# EAGLE design alarm_lamp (EAGLE 8.3.2)

## Sheet 1 of 2: Arduino and peripherals
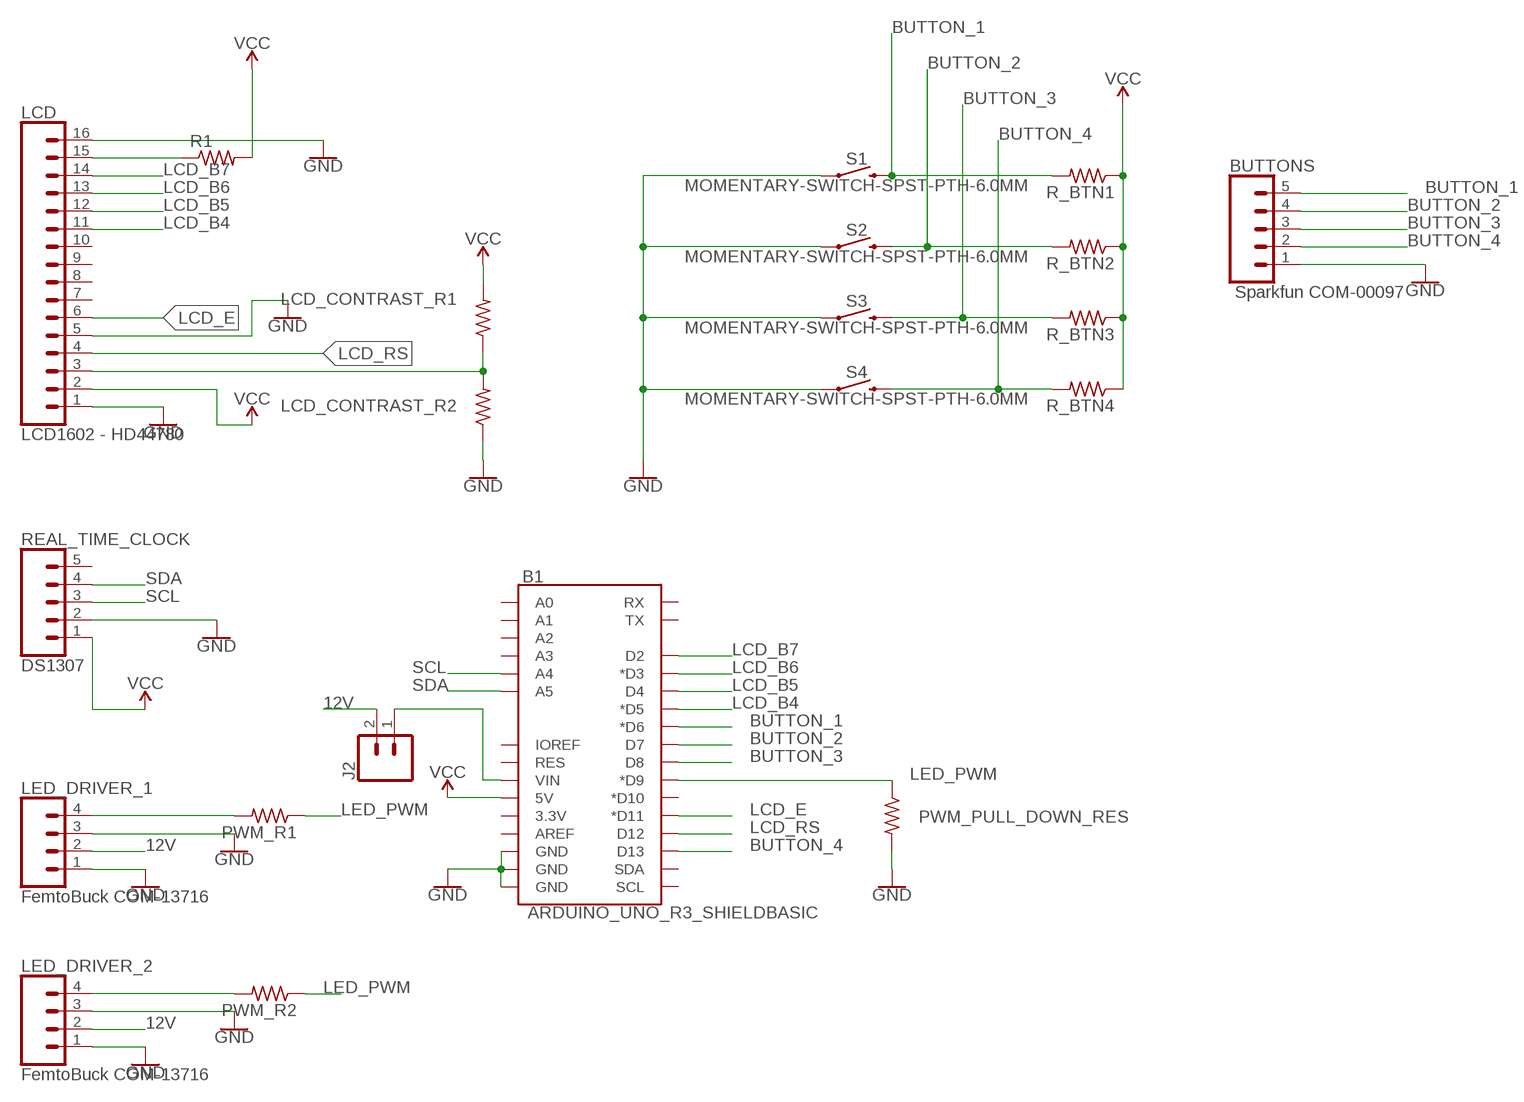
[diagram p0: schematic, sheet 1]

### Parts
B1  ARDUINO_UNO_R3_SHIELDBASIC  [UNO_R3_SHIELD]
BUTTONS  Sparkfun COM-00097  CONN_05  [1X05]
J2  CONN_02  [1X02]
LCD  LCD1602 - HD44780  CONN_16  [1X16]
LCD_CONTRAST_R1  R-US_0207/9  [0207/9]
LCD_CONTRAST_R2  R-US_0207/9  [0207/9]
LED_DRIVER_1  FemtoBuck COM-13716  CONN_04  [1X04]
LED_DRIVER_2  FemtoBuck COM-13716  CONN_04  [1X04]
PWM_PULL_DOWN_RES  R-US_0207/9  [0207/9]
PWM_R1  R-US_0207/9  [0207/9]
PWM_R2  R-US_0207/9  [0207/9]
R1  R-US_0207/9  [0207/9]
R_BTN1  R-US_0207/9  [0207/9]
R_BTN2  R-US_0207/9  [0207/9]
R_BTN3  R-US_0207/9  [0207/9]
R_BTN4  R-US_0207/9  [0207/9]
REAL_TIME_CLOCK  DS1307  CONN_05  [1X05]
S1  MOMENTARY-SWITCH-SPST-PTH-6.0MM  [TACTILE_SWITCH_PTH_6.0MM]
S2  MOMENTARY-SWITCH-SPST-PTH-6.0MM  [TACTILE_SWITCH_PTH_6.0MM]
S3  MOMENTARY-SWITCH-SPST-PTH-6.0MM  [TACTILE_SWITCH_PTH_6.0MM]
S4  MOMENTARY-SWITCH-SPST-PTH-6.0MM  [TACTILE_SWITCH_PTH_6.0MM]

### Nets
12V: J2.2 LED_DRIVER_1.2 LED_DRIVER_2.2 ; also sheet 2
BUTTON_1: B1.D6(*D6) BUTTONS.5 R_BTN1.2 S1.3
BUTTON_2: B1.D7 BUTTONS.4 R_BTN2.2 S2.3
BUTTON_3: B1.D8 BUTTONS.3 R_BTN3.2 S3.3
BUTTON_4: B1.D13 BUTTONS.2 R_BTN4.2 S4.3
GND: B1.GND@0(GND) B1.GND@1(GND) B1.GND@2(GND) BUTTONS.1 LCD.1 LCD.5 LCD.16 LCD_CONTRAST_R2.1 LED_DRIVER_1.1 LED_DRIVER_1.3 LED_DRIVER_2.1 LED_DRIVER_2.3 PWM_PULL_DOWN_RES.2 REAL_TIME_CLOCK.2 S1.1 S2.1 S3.1 S4.1 ; also sheet 2
LCD_B4: B1.D5(*D5) LCD.11
LCD_B5: B1.D4 LCD.12
LCD_B6: B1.D3(*D3) LCD.13
LCD_B7: B1.D2 LCD.14
LCD_E: B1.D11(*D11) LCD.6
LCD_RS: B1.D12 LCD.4
LED_PWM: B1.D9(*D9) PWM_PULL_DOWN_RES.1 PWM_R1.1 PWM_R2.1
N$2: LCD.15 R1.1
N$8: B1.VIN J2.1
N$9: LED_DRIVER_1.4 PWM_R1.2
N$10: LCD.3 LCD_CONTRAST_R1.1 LCD_CONTRAST_R2.2
N$11: LED_DRIVER_2.4 PWM_R2.2
SCL: B1.A4 REAL_TIME_CLOCK.3
SDA: B1.A5 REAL_TIME_CLOCK.4
VCC: B1.5V LCD.2 LCD_CONTRAST_R1.2 R1.2 R_BTN1.1 R_BTN2.1 R_BTN3.1 R_BTN4.1 REAL_TIME_CLOCK.1
Unconnected: B1.3.3V B1.A0 B1.A1 B1.A2 B1.A3 B1.AREF B1.D10(*D10) B1.IOREF B1.RES B1.RX B1.SCL B1.SDA B1.TX LCD.7 LCD.8 LCD.9 LCD.10 REAL_TIME_CLOCK.5

## Sheet 2 of 2: Power
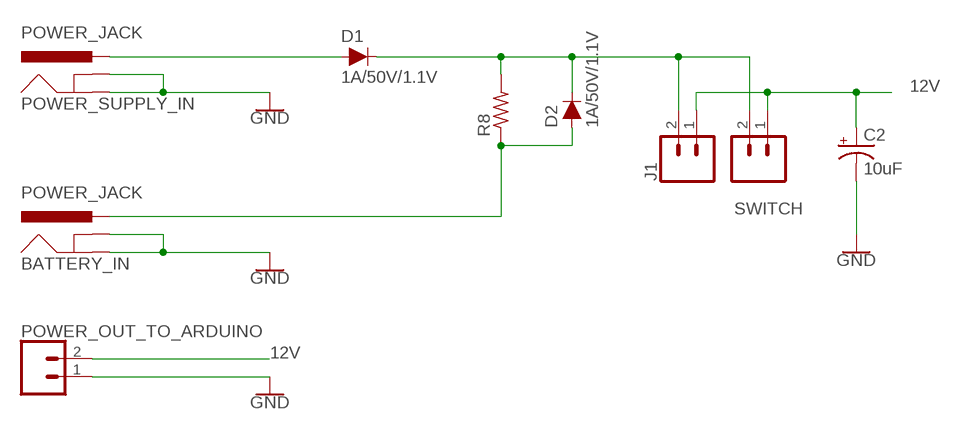
[diagram p1: schematic, sheet 2]

### Parts
BATTERY_IN  POWER_JACK  [POWER_JACK_PTH]
C2  10uF  10UF-POLAR-RADIAL-2.5MM-25V-20%  [CPOL-RADIAL-2.5MM-5MM]
D1  1A/50V/1.1V  DIODE-PTH  [DIODE-1N4001]
D2  1A/50V/1.1V  DIODE-PTH  [DIODE-1N4001]
J1  CONN_02  [1X02]
POWER_OUT_TO_ARDUINO  CONN_023.5MM  [SCREWTERMINAL-3.5MM-2]
POWER_SUPPLY_IN  POWER_JACK  [POWER_JACK_PTH]
R8  R-US_0207/9  [0207/9]
SWITCH  CONN_023.5MM  [SCREWTERMINAL-3.5MM-2]

### Nets
12V: C2.1(+) J1.1 POWER_OUT_TO_ARDUINO.2 SWITCH.1 ; also sheet 1
GND: BATTERY_IN.GND BATTERY_IN.GNDBREAK C2.2(-) POWER_OUT_TO_ARDUINO.1 POWER_SUPPLY_IN.GND POWER_SUPPLY_IN.GNDBREAK ; also sheet 1
N$1: D1.A POWER_SUPPLY_IN.PWR
N$3: D1.C D2.C J1.2 R8.2 SWITCH.2
N$4: BATTERY_IN.PWR D2.A R8.1

## Library data of the parts
B1 = SparkFun-Boards:ARDUINO_UNO_R3_SHIELD: Arduino R3 Shield Footprint Shield form compatible with the Arduino Uno R3. SparkFun Products: MG2639 Cellular Shield <https://www.sparkfun.com/products/13120> MIDI Shield <https://www.sparkfun.com/products/12898> R3 Stackable Headers Kit <https://www.sparkfun.com/products/11417>
BATTERY_IN POWER_SUPPLY_IN = SparkFun-Connectors:POWER_JACK: Power Jack Connector This is the standard 5.5mm barrel jack for power. The PTH is the most common, proven, reliable, footprint. The Slot footprint only works if the mill layer is transmitted to the PCB fab house so be warned. Here are the connectors we sell at SparkFun: DC Barrel Power Jack/Connector <https://www.sparkfun.com/products/119> (PRT-00119) DC Barrel Power Jack/Connector (SMD) <https://www.sparkfun.com/products/12748> (PRT-12748) DC Barrel Jack Adapter - Breadboard Compatible <https://www.sparkfun.com/products/10811> (PRT-10811) It is used on this SparkFun product (and many, many others): SparkFun RedBoard - Programmed with Arduino <https://www.sparkfun.com/products/12757> (DEV-12757) Also, if you need a mating power supply or connector, please check these out: Wall Adapter Power Supply - 9VDC 650mA <https://www.sparkfun.com/products/298> (TOL-00298) DC Barrel Jack Adapter - Male <https://www.sparkfun.com/products/10287> (PRT-10287); PROD_ID: CONN-08197
BUTTONS REAL_TIME_CLOCK = SparkFun-Connectors:CONN_05: Multi connection point. Often used as Generic Header-pin footprint for 0.1 inch spaced/style header connections On any of the 0.1 inch spaced packages, you can populate with these: Break Away Headers - Straight <https://www.sparkfun.com/products/116> (PRT-00116) Break Away Male Headers - Right Angle <https://www.sparkfun.com/products/553> (PRT-00553) Female Headers <https://www.sparkfun.com/products/115> (PRT-00115) Break Away Headers - Machine Pin <https://www.sparkfun.com/products/117> (PRT-00117) Break Away Female Headers - Swiss Machine Pin <https://www.sparkfun.com/products/743> (PRT-00743) For SCREWTERMINALS and SPRING TERMINALS visit here: Screw Terimnals on SparkFun.com <https://www.sparkfun.com/search/results?term=Screw+Terminals> (5mm/3.5mm/2.54mm spacing) This device is also useful as a general connection point to wire up your design to another part of your project. Our various solder wires solder well into these plated through hole pads. Hook-Up Wire - Assortment (Stranded, 22 AWG) <https://www.sparkfun.com/products/11375> (PRT-11375) Hook-Up Wire - Assortment (Solid Core, 22 AWG) <https://www.sparkfun.com/products/11367> (PRT-11367) View the entire wire category on our website here <https://www.sparkfun.com/categories/141> Special notes: Molex polarized connector foot print use with SKU : PRT-08231 with associated crimp pins and housings. 1MM SMD Version SKU: PRT-10208
C2 = SparkFun-Capacitors:10UF-POLAR: 10.0µF polarized capacitors A capacitor is a passive two-terminal electrical component used to store electrical energy temporarily in an electric field.; PROD_ID: CAP-08440
D1 D2 = SparkFun-DiscreteSemi:DIODE: Diode These are standard reverse protection diodes and small signal diodes. SparkFun Products: SparkFun SparkPunk Sound Kit <https://www.sparkfun.com/products/11177> SparkFun ESP8266 Thing <https://www.sparkfun.com/products/13231>; PROD_ID: DIO-09176
J1 J2 = SparkFun-Connectors:CONN_02: Multi connection point. Often used as Generic Header-pin footprint for 0.1 inch spaced/style header connections On any of the 0.1 inch spaced packages, you can populate with these: Break Away Headers - Straight <https://www.sparkfun.com/products/116> (PRT-00116) Break Away Male Headers - Right Angle <https://www.sparkfun.com/products/553> (PRT-00553) Female Headers <https://www.sparkfun.com/products/115> (PRT-00115) Break Away Headers - Machine Pin <https://www.sparkfun.com/products/117> (PRT-00117) Break Away Female Headers - Swiss Machine Pin <https://www.sparkfun.com/products/743> (PRT-00743) For SCREWTERMINALS and SPRING TERMINALS visit here: Screw Terimnals on SparkFun.com <https://www.sparkfun.com/search/results?term=Screw+Terminals> (5mm/3.5mm/2.54mm spacing) This device is also useful as a general connection point to wire up your design to another part of your project. Our various solder wires solder well into these plated through hole pads. Hook-Up Wire - Assortment (Stranded, 22 AWG) <https://www.sparkfun.com/products/11375> (PRT-11375) Hook-Up Wire - Assortment (Solid Core, 22 AWG) <https://www.sparkfun.com/products/11367> (PRT-11367) View the entire wire category on our website here <https://www.sparkfun.com/categories/141> Special notes: Molex polarized connector foot print use with: PRT-08233 with associated crimp pins and housings. 2.54_SCREWTERM for use with PRT-10571. 3.5mm Screw Terminal footprints for PRT-08084 5mm Screw Terminal footprints for use with PRT-08432
LCD = SparkFun-Connectors:CONN_16: Multi connection point. Often used as Generic Header-pin footprint for 0.1 inch spaced/style header connections On any of the 0.1 inch spaced packages, you can populate with these: Break Away Headers - Straight <https://www.sparkfun.com/products/116> (PRT-00116) Break Away Male Headers - Right Angle <https://www.sparkfun.com/products/553> (PRT-00553) Female Headers <https://www.sparkfun.com/products/115> (PRT-00115) Break Away Headers - Machine Pin <https://www.sparkfun.com/products/117> (PRT-00117) Break Away Female Headers - Swiss Machine Pin <https://www.sparkfun.com/products/743> (PRT-00743) For SCREWTERMINALS and SPRING TERMINALS visit here: Screw Terimnals on SparkFun.com <https://www.sparkfun.com/search/results?term=Screw+Terminals> (5mm/3.5mm/2.54mm spacing) This device is also useful as a general connection point to wire up your design to another part of your project. Our various solder wires solder well into these plated through hole pads. Hook-Up Wire - Assortment (Stranded, 22 AWG) <https://www.sparkfun.com/products/11375> (PRT-11375) Hook-Up Wire - Assortment (Solid Core, 22 AWG) <https://www.sparkfun.com/products/11367> (PRT-11367) View the entire wire category on our website here <https://www.sparkfun.com/categories/141> Special notes: Molex polarized connector foot print use with SKU : PRT-08231 with associated crimp pins and housings. 1MM SMD Version SKU: PRT-10208 NOTES ON THE VARIANTS LOCK and LOCK_LONGPADS... This footprint was designed to help hold the alignment of a through-hole component (i.e. 6-pin header) while soldering it into place. You may notice that each hole has been shifted either up or down by 0.005 of an inch from it's more standard position (which is a perfectly straight line). This slight alteration caused the pins (the squares in the middle) to touch the edges of the holes. Because they are alternating, it causes a "brace" to hold the component in place. 0.005 has proven to be the perfect amount of "off-center" position when using our standard breakaway headers. Although looks a little odd when you look at the bare footprint, once you have a header in there, the alteration is very hard to notice. Also,if you push a header all the way into place, it is covered up entirely on the bottom side.
LCD_CONTRAST_R1 LCD_CONTRAST_R2 PWM_PULL_DOWN_RES PWM_R1 PWM_R2 R1 R8 R_BTN1-R_BTN4 = adafruit:R-US_: RESISTOR, American symbol
LED_DRIVER_1 LED_DRIVER_2 = SparkFun-Connectors:CONN_04: Multi connection point. Often used as Generic Header-pin footprint for 0.1 inch spaced/style header connections On any of the 0.1 inch spaced packages, you can populate with these: Break Away Headers - Straight <https://www.sparkfun.com/products/116> (PRT-00116) Break Away Male Headers - Right Angle <https://www.sparkfun.com/products/553> (PRT-00553) Female Headers <https://www.sparkfun.com/products/115> (PRT-00115) Break Away Headers - Machine Pin <https://www.sparkfun.com/products/117> (PRT-00117) Break Away Female Headers - Swiss Machine Pin <https://www.sparkfun.com/products/743> (PRT-00743) For SCREWTERMINALS and SPRING TERMINALS visit here: Screw Terimnals on SparkFun.com <https://www.sparkfun.com/search/results?term=Screw+Terminals> (5mm/3.5mm/2.54mm spacing) This device is also useful as a general connection point to wire up your design to another part of your project. Our various solder wires solder well into these plated through hole pads. Hook-Up Wire - Assortment (Stranded, 22 AWG) <https://www.sparkfun.com/products/11375> (PRT-11375) Hook-Up Wire - Assortment (Solid Core, 22 AWG) <https://www.sparkfun.com/products/11367> (PRT-11367) View the entire wire category on our website here <https://www.sparkfun.com/categories/141> Special notes: Molex polarized connector foot print use with SKU : PRT-08231 with associated crimp pins and housings. 1MM SMD Version SKU: PRT-10208; PROD_ID: CONN-09696
POWER_OUT_TO_ARDUINO SWITCH = SparkFun-Connectors:CONN_02: Multi connection point. Often used as Generic Header-pin footprint for 0.1 inch spaced/style header connections On any of the 0.1 inch spaced packages, you can populate with these: Break Away Headers - Straight <https://www.sparkfun.com/products/116> (PRT-00116) Break Away Male Headers - Right Angle <https://www.sparkfun.com/products/553> (PRT-00553) Female Headers <https://www.sparkfun.com/products/115> (PRT-00115) Break Away Headers - Machine Pin <https://www.sparkfun.com/products/117> (PRT-00117) Break Away Female Headers - Swiss Machine Pin <https://www.sparkfun.com/products/743> (PRT-00743) For SCREWTERMINALS and SPRING TERMINALS visit here: Screw Terimnals on SparkFun.com <https://www.sparkfun.com/search/results?term=Screw+Terminals> (5mm/3.5mm/2.54mm spacing) This device is also useful as a general connection point to wire up your design to another part of your project. Our various solder wires solder well into these plated through hole pads. Hook-Up Wire - Assortment (Stranded, 22 AWG) <https://www.sparkfun.com/products/11375> (PRT-11375) Hook-Up Wire - Assortment (Solid Core, 22 AWG) <https://www.sparkfun.com/products/11367> (PRT-11367) View the entire wire category on our website here <https://www.sparkfun.com/categories/141> Special notes: Molex polarized connector foot print use with: PRT-08233 with associated crimp pins and housings. 2.54_SCREWTERM for use with PRT-10571. 3.5mm Screw Terminal footprints for PRT-08084 5mm Screw Terminal footprints for use with PRT-08432; PROD_ID: CONN-08399
S1-S4 = SparkFun-Switches:MOMENTARY-SWITCH-SPST: Momentary Switch (Pushbutton) - SPST Normally-open (NO) SPST momentary switches (buttons, pushbuttons). Variants PTH-12MM - 12mm square, through-hole Momentary Pushbutton Switch - 12mm Square <https://www.sparkfun.com/products/9190> (COM-09190) PTH-6.0MM, PTH-6.0MM-KIT - 6.0mm square, through-hole Mini Pushbutton Switch <https://www.sparkfun.com/products/97> (COM-00097) KIT package intended for soldering kit's - only one side of pads' copper is exposed. PTH-RIGHT-ANGLE-KIT - Right-angle, through-hole Right Angle Tactile Button <https://www.sparkfun.com/products/10791> - Used on SparkFun BigTime Watch Kit <https://www.sparkfun.com/products/11734> SMD-12MM - 12mm square, surface-mount Tactile Button - SMD (12mm) <https://www.sparkfun.com/products/12993> (COM-12993) Used on SparkFun PicoBoard <https://www.sparkfun.com/products/11888> SMD-4.5MM - 4.5mm Square Trackball Switch Used on SparkFun Blackberry Trackballer Breakout <https://www.sparkfun.com/products/13169> SMD-4.6MMX2.8MM - 4.60mm x 2.80mm, surface mount Used on SparkFun SAMD21 Mini Breakout <https://www.sparkfun.com/products/13664> SMD-5.2MM, SMD-5.2-REDUNDANT - 5.2mm square, surface-mount Mini Pushbutton Switch - SMD <https://www.sparkfun.com/products/8720> (COM-08720) Used on Arduino Pro Mini <https://www.sparkfun.com/products/11114> REDUNDANT package connects both switch circuits together SMD-6.0X3.5MM - 6.0 x 3.5mm, surface mount Momentary Reset Switch SMD <https://www.sparkfun.com/products/8229> (COM-08229) SMD-6.2MM-TALL - 6.2mm square, surface mount Tactile Button - SMD (6mm) <https://www.sparkfun.com/products/12992> Used on SparkFun Digital Sandbox <https://www.sparkfun.com/products/12651> SMD-RIGHT-ANGLE - Right-angle, surface mount Used on SparkFun Block for Intel® Edison - Arduino <https://www.sparkfun.com/products/13036>; PROD_ID: SWCH-08441; SF_SKU: COM-00097

## Board
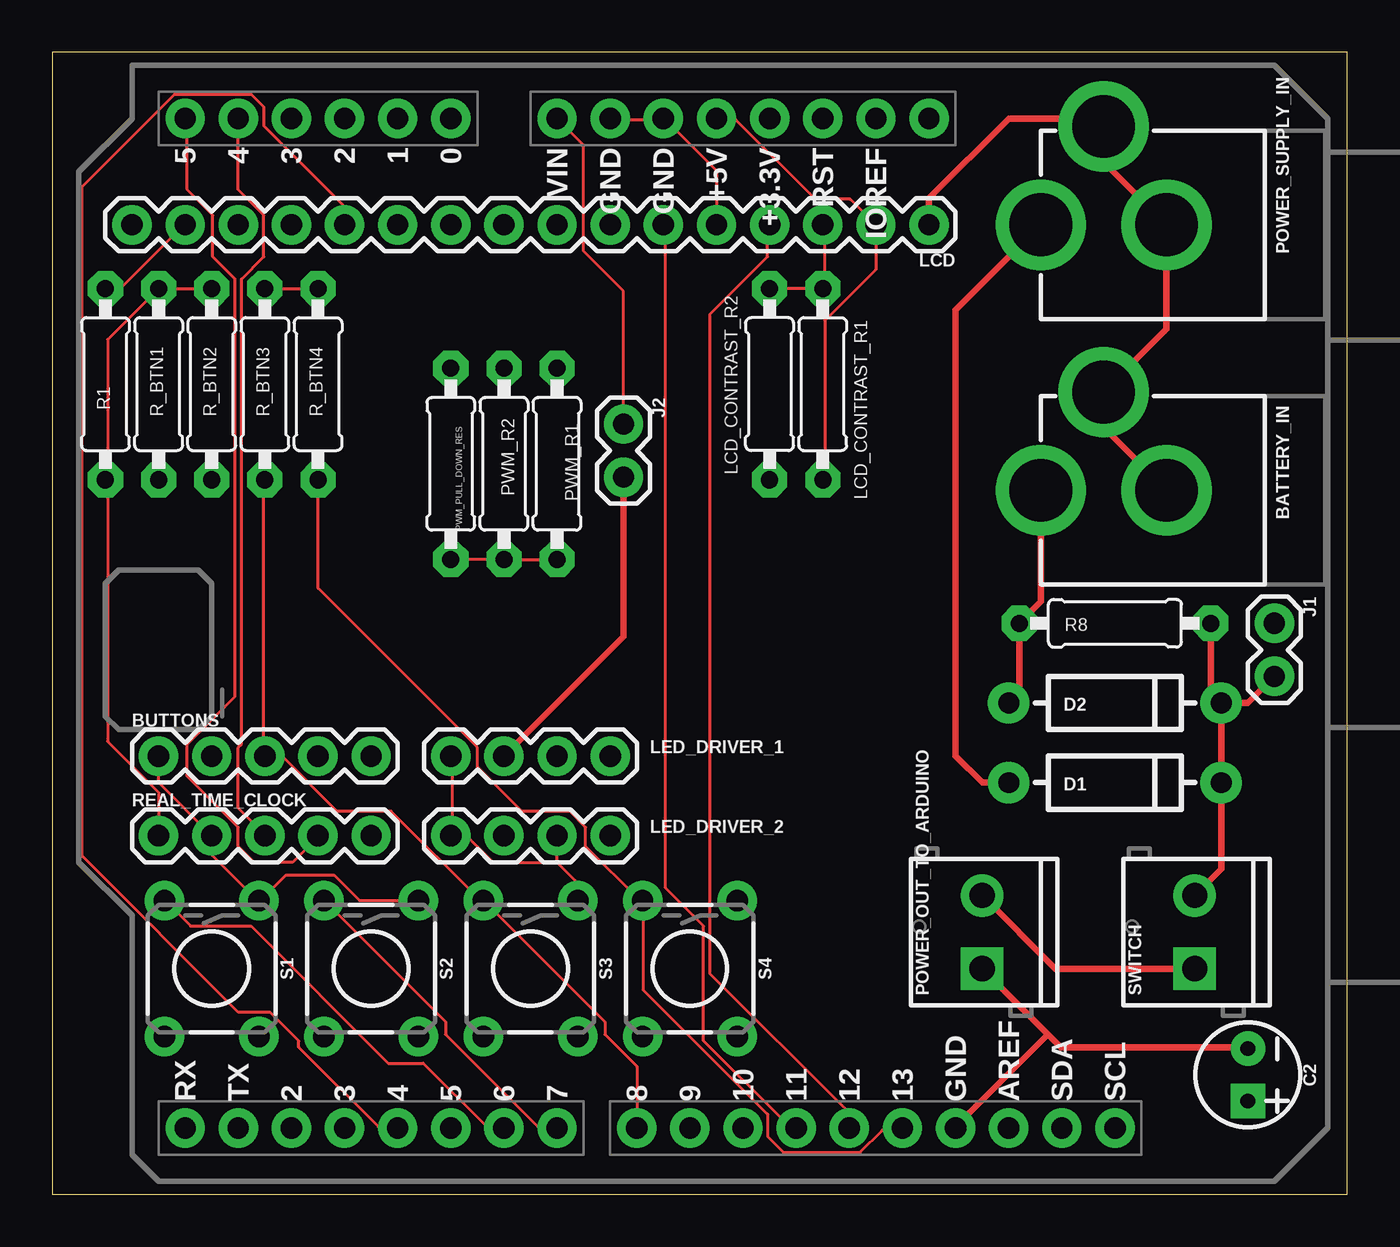
[diagram p2: board, top side]
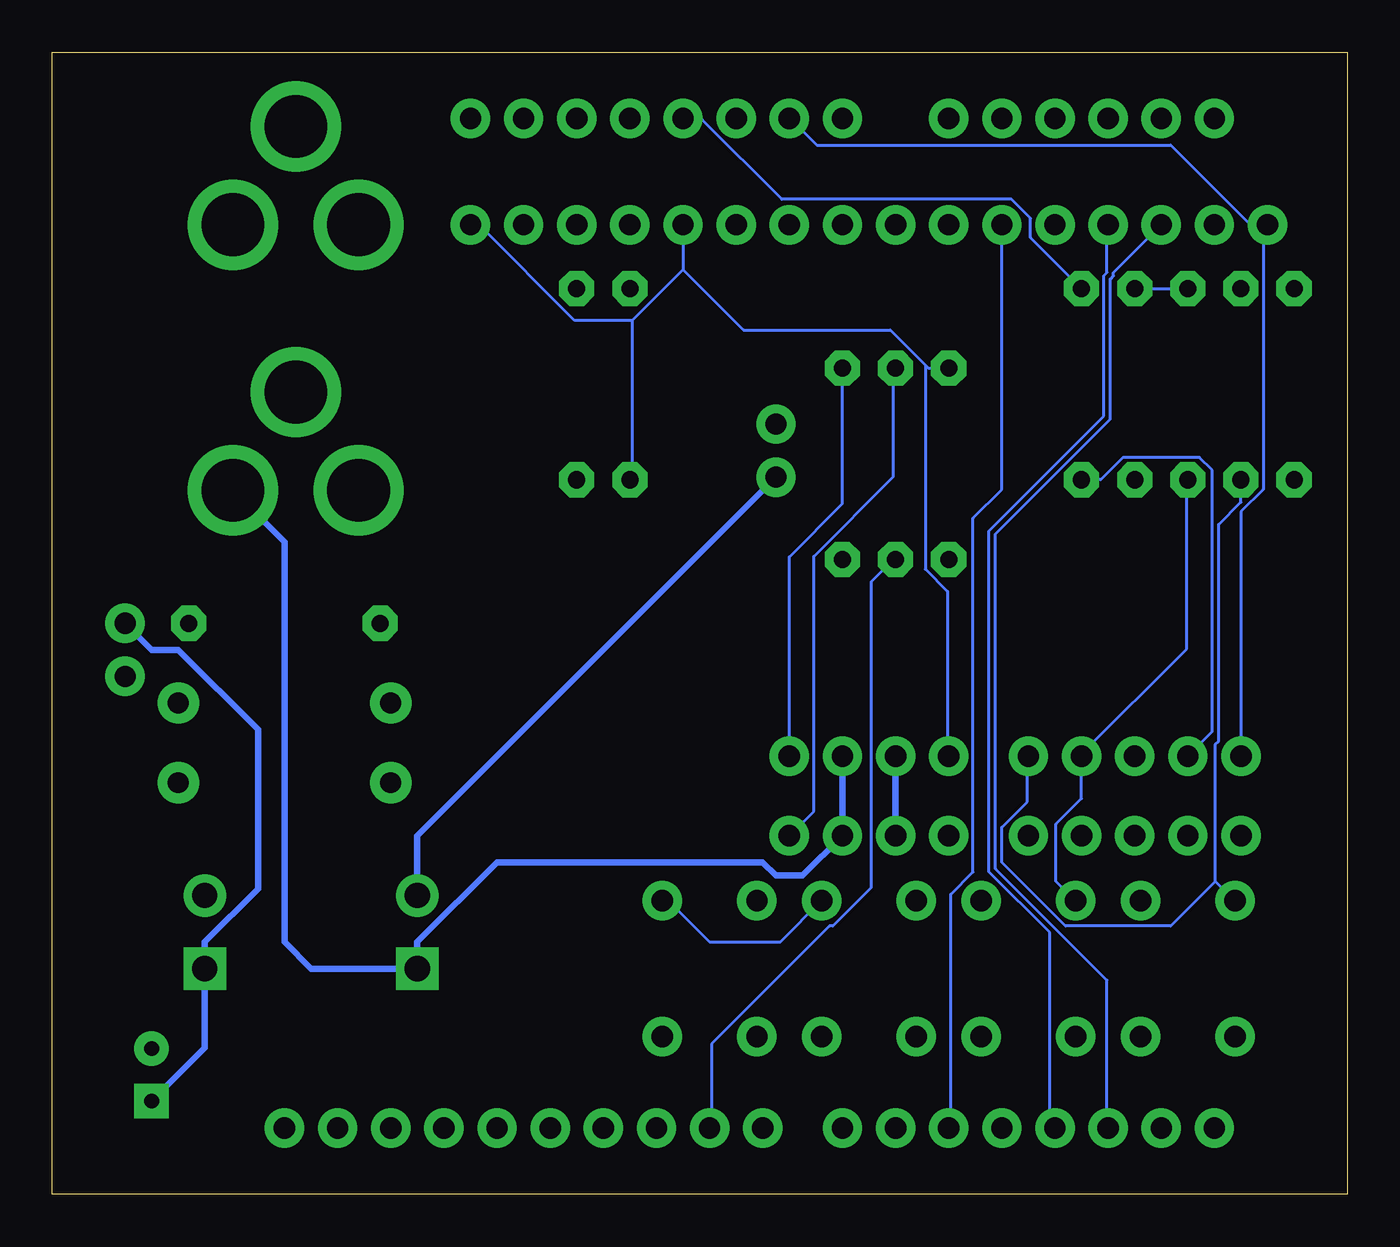
[diagram p3: board, bottom side, seen from below]

Size 61.9 x 54.6 mm. Coordinates in mm from the lower left corner, seen from the top.
Outline: 0,0 61.9,0 61.9,54.6 0,54.6 0,0
Copper layers (1*16): Top 0.035mm / dielectric 1.5mm / Bottom 0.035mm
Design rules "default": minimum track width 6mil, minimum drill 0.35mm, track to track 6mil, track to pad 6mil, pad to pad 6mil, via to via 6mil, smd to smd 6mil, copper to edge 40mil, drill to drill 6mil, minimum pad ring 10mil, minimum via ring 8mil, stop-mask expansion 4mil, vias tented up to drill 0mil, thermal gap 10mil

### Footprints (pad centres in the part's own frame; a part is rotated, then mirrored left to right if it is on the bottom)
UNO_R3_SHIELD = drill 1.016 pad 1.88: 3.3V 24.13,-2.54; 5V 24.13,0; A0 24.13,12.7; A1 24.13,15.24; A2 24.13,17.78; A3 24.13,20.32; A4 24.13,22.86; A5 24.13,25.4; AREF -24.13,-13.97; D2 -24.13,20.32; D3 -24.13,17.78; D4 -24.13,15.24; D5 -24.13,12.7; D6 -24.13,10.16; D7 -24.13,7.62; D8 -24.13,3.81; D9 -24.13,1.27; D10 -24.13,-1.27; D11 -24.13,-3.81; D12 -24.13,-6.35; D13 -24.13,-8.89; GND@0 24.13,2.54; GND@1 24.13,5.08; GND@2 -24.13,-11.43; IOREF 24.13,-7.62; NC 24.13,-10.16; RES 24.13,-5.08; RX -24.13,25.4; SCL -24.13,-19.05; SDA -24.13,-16.51; TX -24.13,22.86; VIN 24.13,7.62
POWER_JACK_PTH = drill 2.997 pad 4.318: GND 0,7.7; GNDBREAK 4.7,10.7; PWR 0,13.7
1X05 = drill 1.016 pad 1.88: 1 0,0; 2 2.54,0; 3 5.08,0; 4 7.62,0; 5 10.16,0
CPOL-RADIAL-2.5MM-5MM = drill 0.7 pad 1.651 square: 1 1.25,0 | drill 0.7 pad 1.651: 2 -1.25,0
DIODE-1N4001 = drill 1 pad 1.981: A -5.08,0; C 5.08,0
1X02 = drill 1.016 pad 1.88: 1 0,0; 2 2.54,0
1X16 = drill 1.016 pad 1.88: 1 0,0; 2 2.54,0; 3 5.08,0; 4 7.62,0; 5 10.16,0; 6 12.7,0; 7 15.24,0; 8 17.78,0; 9 20.32,0; 10 22.86,0; 11 25.4,0; 12 27.94,0; 13 30.48,0; 14 33.02,0; 15 35.56,0; 16 38.1,0
0207/9 = drill 0.813 pad 1.676 octagon: 1 -4.572,0; 2 4.572,0
1X04 = drill 1.016 pad 1.88: 1 0,0; 2 2.54,0; 3 5.08,0; 4 7.62,0
SCREWTERMINAL-3.5MM-2 = drill 1.2 pad 2.032 square: 1 0,0 | drill 1.2 pad 2.032: 2 3.5,0
TACTILE_SWITCH_PTH_6.0MM = drill 1.016 pad 1.88: 1 -3.251,2.261; 2 3.251,2.261; 3 -3.251,-2.261; 4 3.251,-2.261

### Placement (x,y rotation side)
B1  31.75,27.3 90 top
BATTERY_IN  60.96,33.66 90 top
BUTTONS  5.08,20.95 0 top
C2  57.15,5.71 270 top
D1  50.8,19.69 0 top
D2  50.8,23.49 0 top
J1  58.42,27.3 270 top
J2  27.3,36.83 270 top
LCD  41.91,46.35 180 top
LCD_CONTRAST_R1  36.83,38.73 270 top
LCD_CONTRAST_R2  34.29,38.73 90 top
LED_DRIVER_1  19.05,20.95 0 top
LED_DRIVER_2  19.05,17.15 0 top
POWER_OUT_TO_ARDUINO  44.45,10.8 90 top
POWER_SUPPLY_IN  60.96,46.35 90 top
PWM_PULL_DOWN_RES  19.05,34.93 90 top
PWM_R1  24.13,34.93 90 top
PWM_R2  21.59,34.93 90 top
R1  2.54,38.73 270 top
R8  50.8,27.3 0 top
R_BTN1  5.08,38.73 270 top
R_BTN2  7.62,38.73 270 top
R_BTN3  10.16,38.73 270 top
R_BTN4  12.7,38.73 270 top
REAL_TIME_CLOCK  5.08,17.15 0 top
S1  7.62,10.8 270 top
S2  15.24,10.8 270 top
S3  22.86,10.8 270 top
S4  30.48,10.8 270 top
SWITCH  54.61,10.8 90 top

### Tracks (layer width: path | path; a pad name or v marks a point on that pad's centre or on a via)
12V
  Top 0.305: SWITCH.1 47.95,10.8 POWER_OUT_TO_ARDUINO.2 | J2.2 27.3,26.67 LED_DRIVER_1.2
  Bottom 0.305: J1.1 57.15,26.04 55.88,26.04 52.07,22.23 52.07,14.61 54.61,12.07 SWITCH.1 54.61,7.01 C2.1 | POWER_OUT_TO_ARDUINO.2 44.45,17.15 J2.2 | LED_DRIVER_1.2 LED_DRIVER_2.2
BUTTON_1
  Top 0.152: B1.D6 21.54,3.23 20.78,3.23 17.73,6.27 16.05,6.27 9.5,12.83 6.6,12.83 5.38,14.05 S1.3
  Bottom 0.152: R_BTN1.2 5.08,33.1 6.15,32.03 6.15,21.67 6.3,21.51 6.3,14.96 | 6.3,14.96 5.38,14.05 S1.3 | 6.3,14.96 8.43,12.83 13.46,12.83 16.51,15.88 16.51,17.55 15.29,18.77 15.29,20.9 BUTTONS.5
BUTTON_2
  Top 0.152: B1.D7 24.13,3.23 23.22,3.23 18.8,7.64 18.8,8.26 13.01,14.05 S2.3
  Bottom 0.152: R_BTN2.2 7.67,34.16 7.67,26.09 12.7,21.06 BUTTONS.4 12.7,18.92 13.92,17.7 13.92,14.96 13.01,14.05 S2.3
BUTTON_3
  Top 0.152: R_BTN3.2 10.11,34.16 10.11,21.06 BUTTONS.3 10.26,20.9 11.02,20.9 13.61,18.31 16.2,18.31 20.47,14.05 S3.3 20.62,14.05 26.42,8.26 26.42,7.64 27.94,6.12 B1.D8
BUTTON_4
  Top 0.152: B1.D13 40.59,3.07 39.67,3.07 38.61,2.01 34.95,2.01 34.19,2.77 34.19,3.84 28.24,9.78 28.24,14.05 S4.3 28.09,14.05 25.5,16.64 25.5,17.55 24.74,18.31 22.45,18.31 20.32,20.45 20.32,21.36 12.7,28.98 R_BTN4.2
  Bottom 0.152: R_BTN4.2 11.79,34.16 10.72,35.23 7.06,35.23 6.45,34.62 6.45,22.12 BUTTONS.2
GND
  Top 0.152: LED_DRIVER_1.1 19.1,20.9 19.1,17.25 LED_DRIVER_2.1 19.1,17.09 19.86,17.09 21.08,15.88 24.13,15.88 | S3.1 25.04,14.05 25.04,14.96 24.13,15.88 | 57.05,7.04 C2.2 | 43.18,3.23 B1.GND@2 | BUTTONS.1 5.08,19.69 REAL_TIME_CLOCK.2 7.67,17.09 7.67,16.18 9.8,14.05 S1.1 9.96,14.05 11.18,15.27 13.46,15.27 14.68,14.05 S2.1 | B1.GND@1 26.72,51.38 29.16,51.38 B1.GND@0 29.31,51.38 31.75,48.95 LCD.5 | 24.13,15.88 LED_DRIVER_2.3
  Top 0.305: 57.05,7.04 48.21,7.04 47.6,7.64 | POWER_OUT_TO_ARDUINO.1 47.6,7.64 | 47.6,7.64 43.18,3.23 | LCD.1 41.91,47.63 45.72,51.43 49.88,51.43 POWER_SUPPLY_IN.GNDBREAK 50.26,49.35 POWER_SUPPLY_IN.GND 53.26,41.36 BATTERY_IN.GNDBREAK 50.26,36.66 BATTERY_IN.GND
  Bottom 0.152: 34.19,41.78 34.19,34.16 LCD_CONTRAST_R2.1 | 31.75,44.22 34.19,41.78 | LCD.5 31.75,44.22 | PWM_PULL_DOWN_RES.2 20.02,39.5 20.17,39.65 | 20.17,39.65 21.84,41.33 28.85,41.33 31.75,44.22 | LCD.1 41.5,46.35 36.93,41.78 34.19,41.78 | 4.01,46.35 4.62,46.35 8.43,50.16 25.35,50.16 26.57,51.38 B1.GND@1 | 4.01,46.35 LCD.16 3.86,46.35 | BUTTONS.1 5.08,32.64 4.01,33.71 4.01,46.35 | 20.17,39.65 20.17,29.9 19.1,28.83 19.1,21.06 LED_DRIVER_1.1 | S3.1 27.1,12.07 30.48,12.07 32.46,14.05 S4.1
  Bottom 0.305: LED_DRIVER_1.3 LED_DRIVER_2.3 26.03,15.24 27.3,15.24 27.94,15.88 40.64,15.88 44.45,12.07 POWER_OUT_TO_ARDUINO.1 49.53,10.8 50.8,12.07 50.8,31.2 BATTERY_IN.GND
LCD_B4
  Bottom 0.152: LCD.11 16.51,33.71 17.88,32.33 17.88,15.42 18.95,14.35 18.95,3.23 B1.D5
LCD_B5
  Top 0.152: LCD.12 13.92,46.35 13.92,47.27 10.11,51.08 10.11,51.99 9.5,52.6 5.84,52.6 1.42,48.18 1.42,16.18 8.89,8.71 10.41,8.71 11.79,7.34 11.79,7.04 15.6,3.23 16.51,3.23 B1.D4
LCD_B6
  Bottom 0.152: LCD.13 11.48,46.35 11.48,44.07 11.63,43.92 11.63,37.21 17.12,31.73 17.12,15.42 14.22,12.52 14.22,3.38 14.07,3.23 B1.D3
LCD_B7
  Bottom 0.152: LCD.14 11.18,44.07 11.18,43.92 11.33,43.76 11.33,37.06 16.81,31.57 16.81,15.57 11.48,10.24 11.48,3.23 B1.D2
LCD_E
  Top 0.152: LCD.6 29.31,46.35 29.31,14.66 31.14,12.83 31.14,7.34 35.25,3.23 35.56,3.23 B1.D11
LCD_RS
  Top 0.152: LCD.4 34.19,46.35 34.19,44.83 31.45,42.09 31.45,10.54 38,3.99 38,3.23 B1.D12
LED_PWM
  Top 0.152: PWM_PULL_DOWN_RES.1 PWM_R2.1 PWM_R1.1
  Bottom 0.152: B1.D9 30.38,3.23 30.38,7.19 24.74,12.83 24.59,12.83 22.76,14.66 22.76,29.29 21.69,30.35 PWM_R2.1
N$1
  Top 0.305: D1.A 44.45,19.69 43.18,20.95 43.18,42.27 POWER_SUPPLY_IN.PWR
N$2
  Top 0.152: R1.1 3.25,43.31 6.3,46.35 LCD.15
N$3
  Top 0.305: R8.2 55.37,24 D2.C | D2.C 57.15,23.49 J1.2 | D2.C D1.C 55.88,15.56 SWITCH.2
N$4
  Top 0.305: BATTERY_IN.PWR 47.26,28.34 R8.1 46.23,24 D2.A
N$8
  Top 0.152: J2.1 27.3,43.18 25.4,45.09 25.4,50.16 B1.VIN
N$9
  Bottom 0.152: LED_DRIVER_1.4 26.67,30.48 24.13,33.02 PWM_R1.2
N$10
  Top 0.152: LCD_CONTRAST_R2.2 LCD_CONTRAST_R1.1 36.93,43.31 36.93,46.35 LCD.3
N$11
  Bottom 0.152: LED_DRIVER_2.4 25.5,18.31 25.5,30.51 21.69,34.31 21.69,39.5 PWM_R2.2
SCL
  Top 0.152: B1.A4 8.89,48.03 10.11,46.81 10.11,44.83 9.04,43.76 9.04,21.51 8.89,21.36 8.89,18.47 10.11,17.25 REAL_TIME_CLOCK.3
SDA
  Top 0.152: B1.A5 6.45,51.38 6.45,48.03 7.67,46.81 7.67,44.83 8.74,43.76 8.74,23.8 6.45,21.51 6.45,19.99 8.89,17.55 8.89,16.64 9.65,15.88 11.48,15.88 12.7,17.09 REAL_TIME_CLOCK.4
VCC
  Top 0.152: LCD_CONTRAST_R1.2 36.93,34.16 36.93,41.78 39.37,44.22 LCD.2 38.15,47.57 36.47,47.57 32.66,51.38 31.75,51.38 B1.5V | R_BTN3.1 R_BTN4.1 | 2.64,34.16 2.64,40.87 R_BTN1.1 R_BTN2.1 | REAL_TIME_CLOCK.1 5.08,19.23 2.64,21.67 2.64,34.16 | 2.64,34.16 R1.2
  Bottom 0.152: R_BTN3.1 R_BTN2.1 | R_BTN4.1 15.14,45.74 15.14,46.66 16.05,47.57 27.03,47.57 30.84,51.38 31.75,51.38 B1.5V